# Altium schematic sheet [04] Light courtains.SchDoc
size 101 x 101 mm
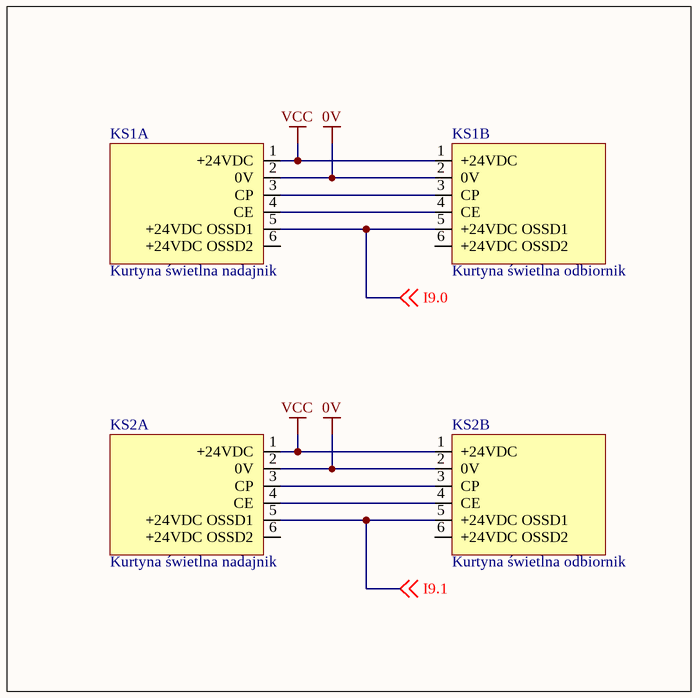
[diagram p0: [04] Light courtains.SchDoc]

## Parts
KS1A  Kurtyna świetlna nadajnik
KS1B  Kurtyna świetlna odbiornik
KS2A  Kurtyna świetlna nadajnik
KS2B  Kurtyna świetlna odbiornik

## Nets
0V: KS1A.2(0V) KS1B.2(0V) KS2A.2(0V) KS2B.2(0V)
VCC: KS1A.1(+24VDC) KS1B.1(+24VDC) KS2A.1(+24VDC) KS2B.1(+24VDC)
I9.0: KS1A.5(+24VDC_OSSD1) KS1B.5(+24VDC_OSSD1) ; off-sheet I9.0
I9.1: KS2A.5(+24VDC_OSSD1) KS2B.5(+24VDC_OSSD1) ; off-sheet I9.1
NetKS1A_3: KS1A.3(CP) KS1B.3(CP)
NetKS1A_4: KS1A.4(CE) KS1B.4(CE)
NetKS2A_3: KS2A.3(CP) KS2B.3(CP)
NetKS2A_4: KS2A.4(CE) KS2B.4(CE)

Not connected (* = marked no-connect by the designer): KS1A 6(+24VDC_OSSD2); KS1B 6(+24VDC_OSSD2); KS2A 6(+24VDC_OSSD2); KS2B 6(+24VDC_OSSD2)

## Library data of the parts
KS1A KS2A = light courtain emiter
KS1B KS2B = light courtain receiver